# Altium project PCB_Project.PrjPcb (part 1 of 2)
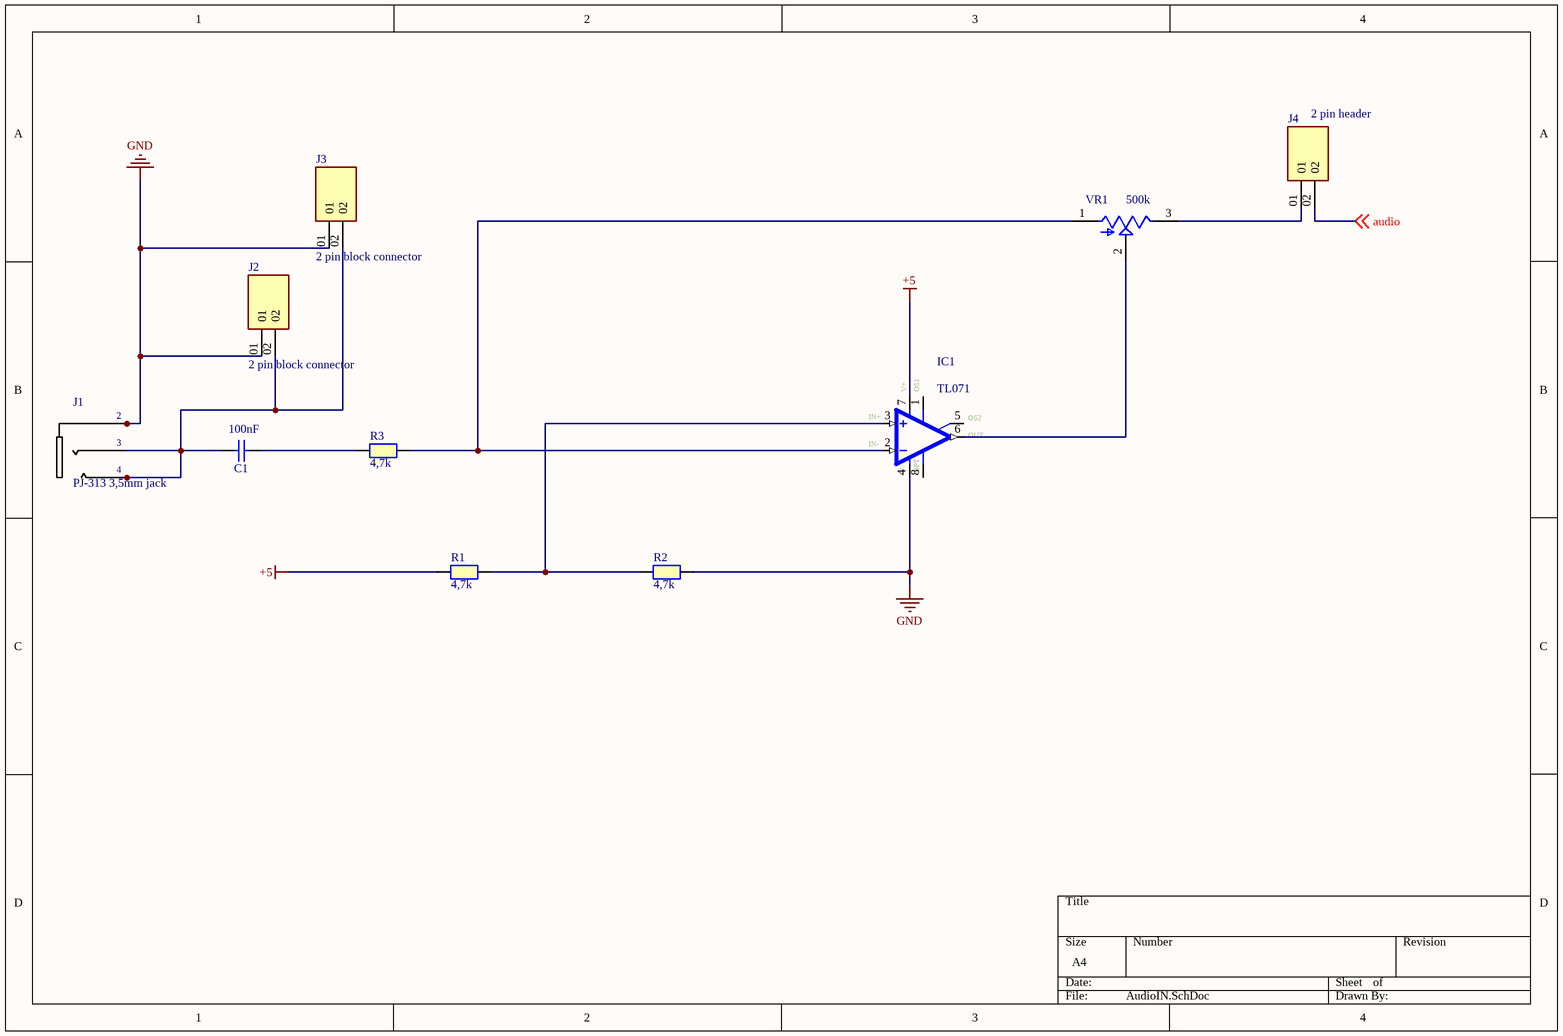
[diagram p0: AudioIN.SchDoc]
6 sheets, 237 parts. Net scope: global (net labels, ports and power ports of the same name join across sheets).
Board file: MB_SpectrumAnalyzerB.PcbDoc
Sheets:
  AudioIN.SchDoc
  spectrum_8kHz_64Hz.SchDoc
  spectrum_4kHz_125Hz.SchDoc
  spectrum_2kHz_250Hz.SchDoc
  spectrum_1kHz_500Hz.SchDoc
  AudioOUT.SchDoc

## Sheet AudioIN.SchDoc
size A4; SheetNumber: 1; SheetTotal: 6

### Parts
C1  100nF  [CAPC2012X65N]
IC1  TL071  [DIL08]
J1  PJ-313 3,5mm jack  [*PJ-313_PJ-313(Primary)]
J2  2 pin block connector  [691210910002]
J3  2 pin block connector  [691210910002]
J4  2 pin header  [SAMTEC_HTSW-102-07-TM-S]
R1  4,7k  [RESC2012X50N]
R2  4,7k  [RESC2012X50N]
R3  4,7k  [RESC2012X50N]
VR1  500k  [TRIM_3362P-1-253LF]

### Nets
+5: IC1.7(V+) R1.1
GND: IC1.4(V-) J1.2_1 J1.2_2 J2.01 J3.01 R2.2
audio: J4.02 ; off-sheet audio
NetC1_1: C1.1 J1.3 J1.4_1 J1.4_2 J2.02 J3.02
NetC1_2: C1.2 R3.1
NetIC1_2: IC1.2(-IN) R3.2 VR1.1(CCW)
NetIC1_3: IC1.3(+IN) R1.2 R2.1
NetIC1_6: IC1.6(OUT) VR1.2(WIPER)
NetJ4_01: J4.01 VR1.3(CW)

Not connected (* = marked no-connect by the designer): IC1 1(ON1) 5(ON2) 8(OPT)

### Notes on the sheet
- (in symbol TL071) OS1; IN+; OS2; IN-

### Library data of the parts
C1 = 885012004008: 100nF Keramic cap; Manufacturer: Wurth Elektronik; Match Code: WCAP-CSGP; Case/Size Code: 0201; Capacitance: 22pF; Capacitance Tolerance: +/-5%; Ceramic Type: NP0 Class I; Insulation Resistance: 10GΩ; Q Factor: 840; Rated Voltage (DC): 25V; Technical Reference: NP00201220J025DFCT10000; Manufacturer Part Number: 885012004008; Category: Multilayer Ceramic Chip Capacitors; ComponentLink1Description: Website Link; ComponentLink1URL: https://www.we-online.com/redexpert/article/885012004008?ad; ComponentLink2Description: Datasheet Link; ComponentLink2URL: https://www.we-online.com/redexpert/spec/885012004008?ad; Mount: Surface Mount; Operating Temperature Max: 125°C; Operating Temperature Min: -55°C; Packaging: Tape and Reel; Length: 0.6mm; Width: 0.3mm; Height: 0.3mm
IC1 = TL071: J-FET Amplifier 1 Circuit 8-SO; MF: STMicroelectronics; Price: None; SnapEDA_Link: https://www.snapeda.com/parts/TL071/STMicroelectronics/view-part/1566080/?ref=snap; Availability: Unavailable; Value: *; MP: TL071; Package: SOIC-8 STMicroelectronics
J1 = PJ-313: 3,5cm jack; MP: PJ313; MF: ADC Telecommunications; Package: None; Availability: Not in stock; Check_prices: https://www.snapeda.com/parts/PJ313/ADC+Telecommunications/view-part/?ref=eda; SnapEDA_Link: https://www.snapeda.com/parts/PJ313/ADC+Telecommunications/view-part/?ref=snap; Price: None; Value: *
J2 J3 = 2 pin header: HEADER, 2 CONTACTS, 1 ROW, THROUGH HOLE, 2.54 MM; Connector Systems:Board-to-Board; Pitch Spacing:2.54mm; No. of Rows:1Rows; No. of Contacts:2Contacts; Contact Termination Type:Through Hole; Product Range:HTSW Series; Gender:Header RoHS Compliant: Yes; MP: HTSW10207TMS; MF: Samtec; SnapEDA_Link: https://www.snapeda.com/parts/HTSW10207TMS/Samtec/view-part/?ref=snap; Value: *; Purchase-URL: https://pricing.snapeda.com/search/part/HTSW10207TMS/?ref=eda; Availability: In Stock; Check_prices: https://www.snapeda.com/parts/HTSW10207TMS/Samtec/view-part/?ref=eda; Package: None; Price: None
J4 = 2 pin header: 2 pin header Jumper; MP: HTSW10207TMS; MF: Samtec; SnapEDA_Link: https://www.snapeda.com/parts/HTSW10207TMS/Samtec/view-part/?ref=snap; Value: *; Purchase-URL: https://pricing.snapeda.com/search/part/HTSW10207TMS/?ref=eda; Availability: In Stock; Check_prices: https://www.snapeda.com/parts/HTSW10207TMS/Samtec/view-part/?ref=eda; Package: None; Price: None
R1-R3 = RESISTOR 0805: 4,7k Resistor 0805; Part Number: TNPW080510K0BETA; Manufacturer: Vishay Dale
VR1 = 3362P-1-253LF: 25 kOhms 0.5W, 1/2W PC Pins Through Hole Trimmer Potentiometer Cermet 1 Turn Top Adjustment; MF: Bourns; Check_prices: https://www.snapeda.com/parts/3362P-1-253LF/Bourns/view-part/493663/?ref=eda; SnapEDA_Link: https://www.snapeda.com/parts/3362P-1-253LF/Bourns/view-part/493663/?ref=snap; Availability: Good; Value: *; Purchase-URL: https://pricing.snapeda.com/search/part/3362P-1-253LF/?ref=eda; Price: None; MP: 3362P-1-253LF; Package: 3116 Bourns

## Sheet spectrum_8kHz_64Hz.SchDoc
size A4; SheetNumber: 2; SheetTotal: 6
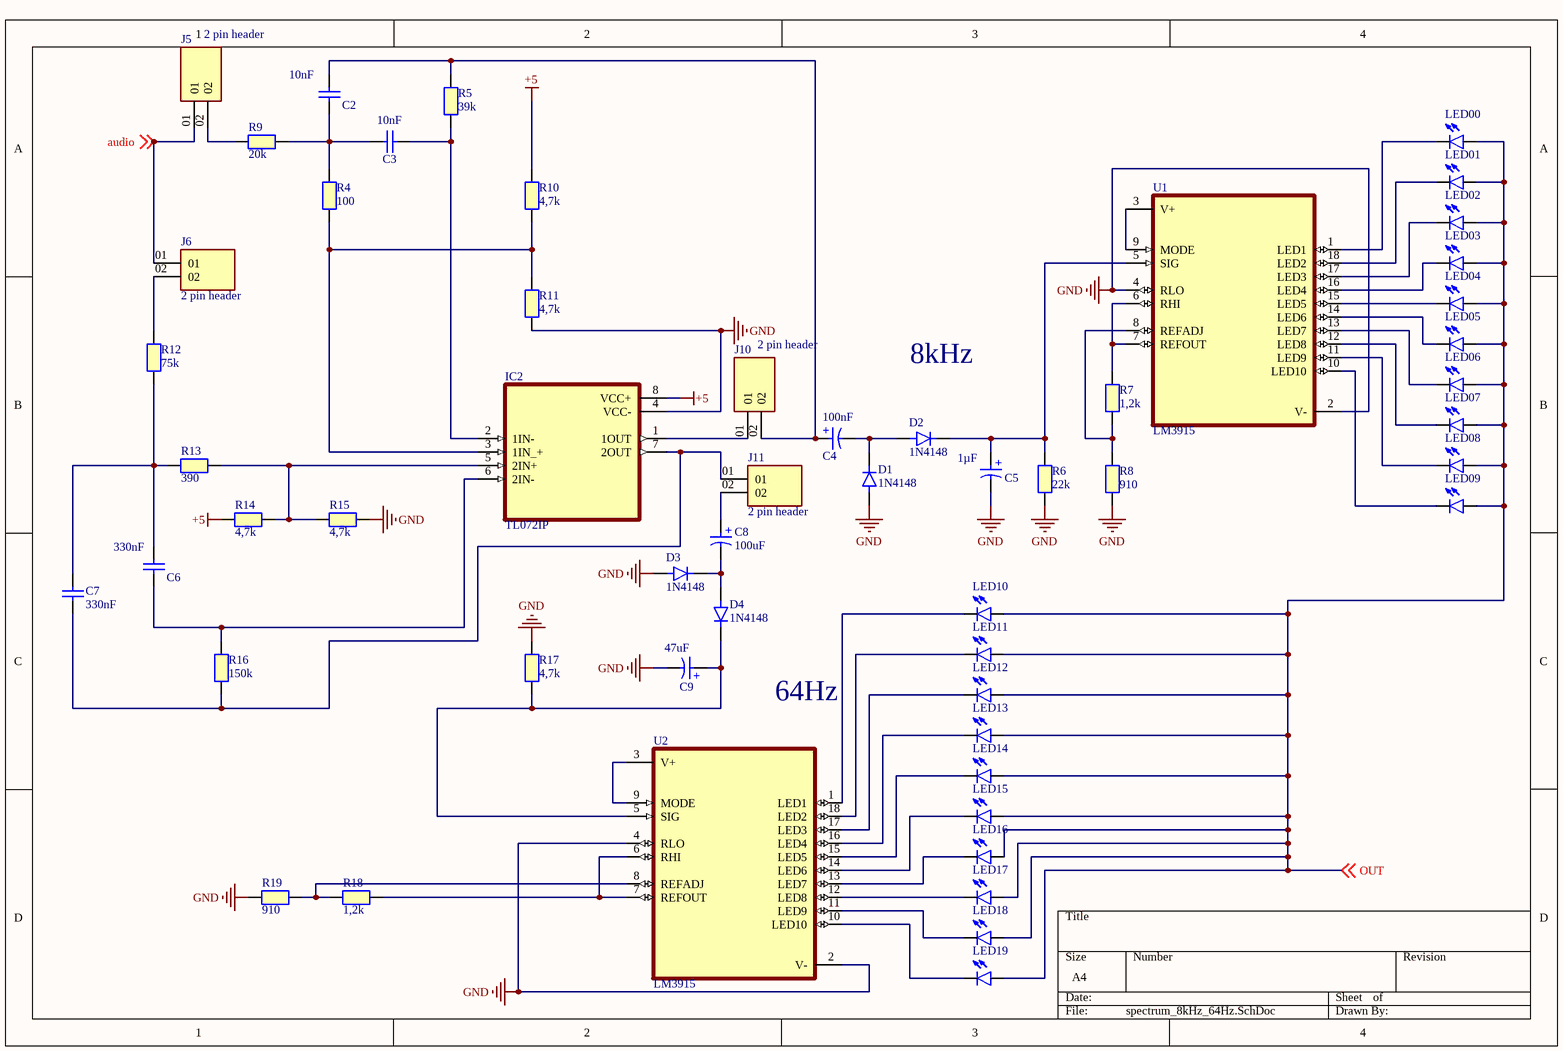
[diagram p1: spectrum_8kHz_64Hz.SchDoc]

### Parts
C2  10nF  [CAPC2012X65N]
C3  10nF  [CAPC2012X65N]
C4  100nF  [WCAP-ATG8_D5H11]
C5  1µF  [WCAP-ATG8_D5H11]
C6  330nF  [CAPC2012X65N]
C7  330nF  [CAPC2012X65N]
C8  100uF  [WCAP-ATG8_D5H11]
C9  47uF  [WCAP-ATG8_D5H11]
D1  1N4148  [DIOAD829W49L456D191]
D2  1N4148  [DIOAD829W49L456D191]
D3  1N4148  [DIOAD829W49L456D191]
D4  1N4148  [DIOAD829W49L456D191]
IC2  TL072IP  [DIP794W45P254L959H508Q8]
J5  2 pin header  [SAMTEC_HTSW-102-07-TM-S]
J6  2 pin header  [SAMTEC_HTSW-102-07-TM-S]
J10  2 pin header  [SAMTEC_HTSW-102-07-TM-S]
J11  2 pin header  [SAMTEC_HTSW-102-07-TM-S]
LED00  LED 2x3x4  [LED 2x3x4mm]  (value not drawn)
LED01  LED 2x3x4  [LED 2x3x4mm]  (value not drawn)
LED02  LED 2x3x4  [LED 2x3x4mm]  (value not drawn)
LED03  LED 2x3x4  [LED 2x3x4mm]  (value not drawn)
LED04  LED 2x3x4  [LED 2x3x4mm]  (value not drawn)
LED05  LED 2x3x4  [LED 2x3x4mm]  (value not drawn)
LED06  LED 2x3x4  [LED 2x3x4mm]  (value not drawn)
LED07  LED 2x3x4  [LED 2x3x4mm]  (value not drawn)
LED08  LED 2x3x4  [LED 2x3x4mm]  (value not drawn)
LED09  LED 2x3x4  [LED 2x3x4mm]  (value not drawn)
LED10  LED 2x3x4  [LED 2x3x4mm]  (value not drawn)
LED11  LED 2x3x4  [LED 2x3x4mm]  (value not drawn)
LED12  LED 2x3x4  [LED 2x3x4mm]  (value not drawn)
LED13  LED 2x3x4  [LED 2x3x4mm]  (value not drawn)
LED14  LED 2x3x4  [LED 2x3x4mm]  (value not drawn)
LED15  LED 2x3x4  [LED 2x3x4mm]  (value not drawn)
LED16  LED 2x3x4  [LED 2x3x4mm]  (value not drawn)
LED17  LED 2x3x4  [LED 2x3x4mm]  (value not drawn)
LED18  LED 2x3x4  [LED 2x3x4mm]  (value not drawn)
LED19  LED 2x3x4  [LED 2x3x4mm]  (value not drawn)
R4  100  [RESC2012X50N]
R5  39k  [RESC2012X50N]
R6  22k  [RESC2012X50N]
R7  1,2k  [RESC2012X50N]
R8  910  [RESC2012X50N]
R9  20k  [RESC2012X50N]
R10  4,7k  [RESC2012X50N]
R11  4,7k  [RESC2012X50N]
R12  75k  [RESC2012X50N]
R13  390  [RESC2012X50N]
R14  4,7k  [RESC2012X50N]
R15  4,7k  [RESC2012X50N]
R16  150k  [RESC2012X50N]
R17  4,7k  [RESC2012X50N]
R18  1,2k  [RESC2012X50N]
R19  910  [RESC2012X50N]
U1  LM3915  [DIP952W45P254L2336H533Q18]
U2  LM3915  [DIP952W45P254L2336H533Q18]

### Nets
+5: IC2.8(VCC+) R10.2 R14.2
GND: C5.2(N) C9.2(N) D1.A D3.A IC2.4(VCC-) R6.1 R8.2 R11.1 R15.2 R17.1 R19.2 U1.2(V-) U1.4(RLO) U2.2(V-) U2.4(RLO)
audio: J5.01 J6.01 ; off-sheet audio
OUT: LED00.A LED01.A LED02.A LED03.A LED04.A LED05.A LED06.A LED07.A LED08.A LED09.A LED10.A LED11.A LED12.A LED13.A LED14.A LED15.A LED16.A LED17.A LED18.A LED19.A ; off-sheet OUT
NetC2_1: C2.1 C3.1 R4.2 R9.2
NetC2_2: C2.2 C4.1(P) J10.02 R5.2
NetC3_2: C3.2 IC2.2(1IN-) R5.1
NetC4_2: C4.2(N) D1.C D2.A
NetC5_1: C5.1(P) D2.C R6.2 U1.5(SIG)
NetC6_1: C6.1 IC2.6(2IN-) R16.2
NetC6_2: C6.2 C7.2 R12.1 R13.2
NetC7_1: C7.1 IC2.7(2OUT) J11.01 R16.1
NetC8_1: C8.1(P) J11.02
NetC8_2: C8.2(N) D3.C D4.A
NetC9_1: C9.1(P) D4.C R17.2 U2.5(SIG)
NetIC2_1: IC2.1(1OUT) J10.01
NetIC2_3: IC2.3(1IN_+) R4.1 R10.1 R11.2
NetIC2_5: IC2.5(2IN+) R13.1 R14.1 R15.1
NetJ5_02: J5.02 R9.1
NetJ6_02: J6.02 R12.2
NetLED00_K: LED00.K(C) U1.1(LED1)
NetLED01_K: LED01.K(C) U1.18(LED2)
NetLED02_K: LED02.K(C) U1.17(LED3)
NetLED03_K: LED03.K(C) U1.16(LED4)
NetLED04_K: LED04.K(C) U1.15(LED5)
NetLED05_K: LED05.K(C) U1.14(LED6)
NetLED06_K: LED06.K(C) U1.13(LED7)
NetLED07_K: LED07.K(C) U1.12(LED8)
NetLED08_K: LED08.K(C) U1.11(LED9)
NetLED09_K: LED09.K(C) U1.10(LED10)
NetLED10_K: LED10.K(C) U2.1(LED1)
NetLED11_K: LED11.K(C) U2.18(LED2)
NetLED12_K: LED12.K(C) U2.17(LED3)
NetLED13_K: LED13.K(C) U2.16(LED4)
NetLED14_K: LED14.K(C) U2.15(LED5)
NetLED15_K: LED15.K(C) U2.14(LED6)
NetLED16_K: LED16.K(C) U2.13(LED7)
NetLED17_K: LED17.K(C) U2.12(LED8)
NetLED18_K: LED18.K(C) U2.11(LED9)
NetLED19_K: LED19.K(C) U2.10(LED10)
NetR7_1: R7.1 U1.6(RHI) U1.7(REFOUT)
NetR7_2: R7.2 R8.1 U1.8(REFADJ)
NetR18_1: R18.1 U2.6(RHI) U2.7(REFOUT)
NetR18_2: R18.2 R19.1 U2.8(REFADJ)
NetU1_3: U1.3(V+) U1.9(MODE)
NetU2_3: U2.3(V+) U2.9(MODE)

### Notes on the sheet
- 8kHz
- 64Hz
- (in symbol 860010272005) +

### Library data of the parts
C2 C3 = 885012004008: 10nF ceramic; Manufacturer: Wurth Elektronik; Match Code: WCAP-CSGP; Case/Size Code: 0201; Capacitance: 22pF; Capacitance Tolerance: +/-5%; Ceramic Type: NP0 Class I; Insulation Resistance: 10GΩ; Q Factor: 840; Rated Voltage (DC): 25V; Technical Reference: NP00201220J025DFCT10000; Manufacturer Part Number: 885012004008; Category: Multilayer Ceramic Chip Capacitors; ComponentLink1Description: Website Link; ComponentLink1URL: https://www.we-online.com/redexpert/article/885012004008?ad; ComponentLink2Description: Datasheet Link; ComponentLink2URL: https://www.we-online.com/redexpert/spec/885012004008?ad; Mount: Surface Mount; Operating Temperature Max: 125°C; Operating Temperature Min: -55°C; Packaging: Tape and Reel; Length: 0.6mm; Width: 0.3mm; Height: 0.3mm
C4 = 860010272005: Elco 100nF; Manufacturer: Wurth Elektronik; Match Code: WCAP-ATG8; Capacitance: 100µF; Capacitance Tolerance: +/-20%; Dissipation Factor: 19%; Endurance: 2000h; Leakage Current: 10µA; Rated Voltage (DC): 10V; Ripple Current: 198mA; Technical Reference: ATBC110101M010DSPA3B000; Manufacturer Part Number: 860010272005; Category: Aluminum Electrolytic Capacitors; ComponentLink1Description: Website Link; ComponentLink1URL: https://www.we-online.com/redexpert/article/860010272005?ad; ComponentLink2Description: Datasheet Link; ComponentLink2URL: https://www.we-online.com/redexpert/spec/860010272005?ad; Mount: Through Hole; Operating Temperature Max: 85°C; Operating Temperature Min: -40°C; Packaging: Ammo Pack; Height: 11mm; Diameter: 5mm
C5 = 860010272005: WCAP-ATG8 Aluminum Electrolytic Capacitor, Radial, THT, D5 x H11mm, 1uF, 10V; Manufacturer: Wurth Elektronik; Capacitance: 100µF; Capacitance Tolerance: +/-20%; Dissipation Factor: 19%; Endurance: 2000h; Leakage Current: 10µA; Ripple Current: 198mA; Technical Reference: ATBC110101M010DSPA3B000; Manufacturer Part Number: 860010272005; Category: Aluminum Electrolytic Capacitors; Match Code: WCAP-ATG8; ComponentLink1Description: Website Link; ComponentLink1URL: https://www.we-online.com/redexpert/article/860010272005?ad; ComponentLink2Description: Datasheet Link; ComponentLink2URL: https://www.we-online.com/redexpert/spec/860010272005?ad; Mount: Through Hole; Operating Temperature Max: 85°C; Operating Temperature Min: -40°C; Packaging: Ammo Pack; Height: 11mm; Diameter: 5mm; Rated Voltage (DC): 10V
C6 C7 = 885012004008: 330nF ceramic; Manufacturer: Wurth Elektronik; Match Code: WCAP-CSGP; Case/Size Code: 0201; Capacitance: 22pF; Capacitance Tolerance: +/-5%; Ceramic Type: NP0 Class I; Insulation Resistance: 10GΩ; Q Factor: 840; Rated Voltage (DC): 25V; Technical Reference: NP00201220J025DFCT10000; Manufacturer Part Number: 885012004008; Category: Multilayer Ceramic Chip Capacitors; ComponentLink1Description: Website Link; ComponentLink1URL: https://www.we-online.com/redexpert/article/885012004008?ad; ComponentLink2Description: Datasheet Link; ComponentLink2URL: https://www.we-online.com/redexpert/spec/885012004008?ad; Mount: Surface Mount; Operating Temperature Max: 125°C; Operating Temperature Min: -55°C; Packaging: Tape and Reel; Length: 0.6mm; Width: 0.3mm; Height: 0.3mm
C8 = 860010272005: Elco 100uF; Manufacturer: Wurth Elektronik; Match Code: WCAP-ATG8; Capacitance: 100µF; Capacitance Tolerance: +/-20%; Dissipation Factor: 19%; Endurance: 2000h; Leakage Current: 10µA; Rated Voltage (DC): 10V; Ripple Current: 198mA; Technical Reference: ATBC110101M010DSPA3B000; Manufacturer Part Number: 860010272005; Category: Aluminum Electrolytic Capacitors; ComponentLink1Description: Website Link; ComponentLink1URL: https://www.we-online.com/redexpert/article/860010272005?ad; ComponentLink2Description: Datasheet Link; ComponentLink2URL: https://www.we-online.com/redexpert/spec/860010272005?ad; Mount: Through Hole; Operating Temperature Max: 85°C; Operating Temperature Min: -40°C; Packaging: Ammo Pack; Height: 11mm; Diameter: 5mm
C9 = 860010272005: WCAP-ATG8 Aluminum Electrolytic Capacitor, Radial, THT, D5 x H11mm, 47µF, 10V; Manufacturer: Wurth Elektronik; Capacitance: 100µF; Capacitance Tolerance: +/-20%; Dissipation Factor: 19%; Endurance: 2000h; Leakage Current: 10µA; Ripple Current: 198mA; Technical Reference: ATBC110101M010DSPA3B000; Manufacturer Part Number: 860010272005; Category: Aluminum Electrolytic Capacitors; Match Code: WCAP-ATG8; ComponentLink1Description: Website Link; ComponentLink1URL: https://www.we-online.com/redexpert/article/860010272005?ad; ComponentLink2Description: Datasheet Link; ComponentLink2URL: https://www.we-online.com/redexpert/spec/860010272005?ad; Mount: Through Hole; Operating Temperature Max: 85°C; Operating Temperature Min: -40°C; Packaging: Ammo Pack; Height: 11mm; Diameter: 5mm; Rated Voltage (DC): 10V
D1-D4 = 1N4148: Diode Standard 75V 200mA Surface Mount SOD-523F; MF: ON Semiconductor; Price: None; Availability: In Stock; Package: AXIAL LEAD-2 ON Semiconductor; MP: 1N4148; Value: *; SnapEDA_Link: https://www.snapeda.com/parts/1N4148/Onsemi/view-part/?ref=snap; Purchase-URL: https://pricing.snapeda.com/search/part/1N4148/?ref=eda; Check_prices: https://www.snapeda.com/parts/1N4148/Onsemi/view-part/?ref=eda
IC2 = TL072IP: Dual, 30-V, 3-MHz, high slew rate (13-V/Âµs), In to V+, JFET-input op amp; MF: Texas Instruments; Price: None; Package: PDIP-8 Texas; Purchase-URL: https://pricing.snapeda.com/search/part/TL072IP/?ref=eda; Availability: In Stock; SnapEDA_Link: https://www.snapeda.com/parts/TL072IP/Texas+Instruments/view-part/?ref=snap; Value: *; MP: TL072IP; Check_prices: https://www.snapeda.com/parts/TL072IP/Texas+Instruments/view-part/?ref=eda
J5 J6 J10 J11 = 2 pin header: as J4 on sheet AudioIN; SnapEDA_Link: https://www.snapeda.com/parts/HTSW10207TMS/Samtec/view-part/?ref=snap; Value: *; Purchase-URL: https://pricing.snapeda.com/search/part/HTSW10207TMS/?ref=eda; Availability: In Stock; Check_prices: https://www.snapeda.com/parts/HTSW10207TMS/Samtec/view-part/?ref=eda; Package: None; Price: None
LED00 LED01 LED02 LED03 LED04 LED05 LED06 LED07 LED08 LED09-LED19 = LED 2x3x4: Green 569nm LED Indication - Discrete 1.9V Radial; MP: TLLG4400; MF: Vishay Semiconductors; SnapEDA_Link: https://www.snapeda.com/parts/TLLG4400/Vishay/view-part/?ref=snap; Availability: In Stock; Package: None; Check_prices: https://www.snapeda.com/parts/TLLG4400/Vishay/view-part/?ref=eda; Value: *; Purchase-URL: https://pricing.snapeda.com/search/part/TLLG4400/?ref=eda; Price: None
R4 = RESISTOR 0805: 100Ohm Resistor 0805; Part Number: TNPW080510K0BETA; Manufacturer: Vishay Dale
R5 R10 R11 R14 R15 R17 = RESISTOR 0805: as R1 on sheet AudioIN
R6 = RESISTOR 0805: 22k Resistor 0805; Part Number: TNPW080510K0BETA; Manufacturer: Vishay Dale
R7 R18 = RESISTOR 0805: 1,2k Resistor 0805; Part Number: TNPW080510K0BETA; Manufacturer: Vishay Dale
R8 R19 = RESISTOR 0805: 910 Resistor 0805; Part Number: TNPW080510K0BETA; Manufacturer: Vishay Dale
R9 = RESISTOR 0805: 20k Resistor 0805; Part Number: TNPW080510K0BETA; Manufacturer: Vishay Dale
R12 = RESISTOR 0805: 75k Resistor 0805; Part Number: TNPW080510K0BETA; Manufacturer: Vishay Dale
R13 = RESISTOR 0805: 390 Resistor 0805; Part Number: TNPW080510K0BETA; Manufacturer: Vishay Dale
R16 = RESISTOR 0805: 150k Resistor 0805; Part Number: TNPW080510K0BETA; Manufacturer: Vishay Dale
U1 U2 = LM3915: MP: LM3914N-1; Package: None; Availability: Unavailable; Price: None; Value: *

## Sheet spectrum_4kHz_125Hz.SchDoc
size A4; SheetNumber: 3; SheetTotal: 6
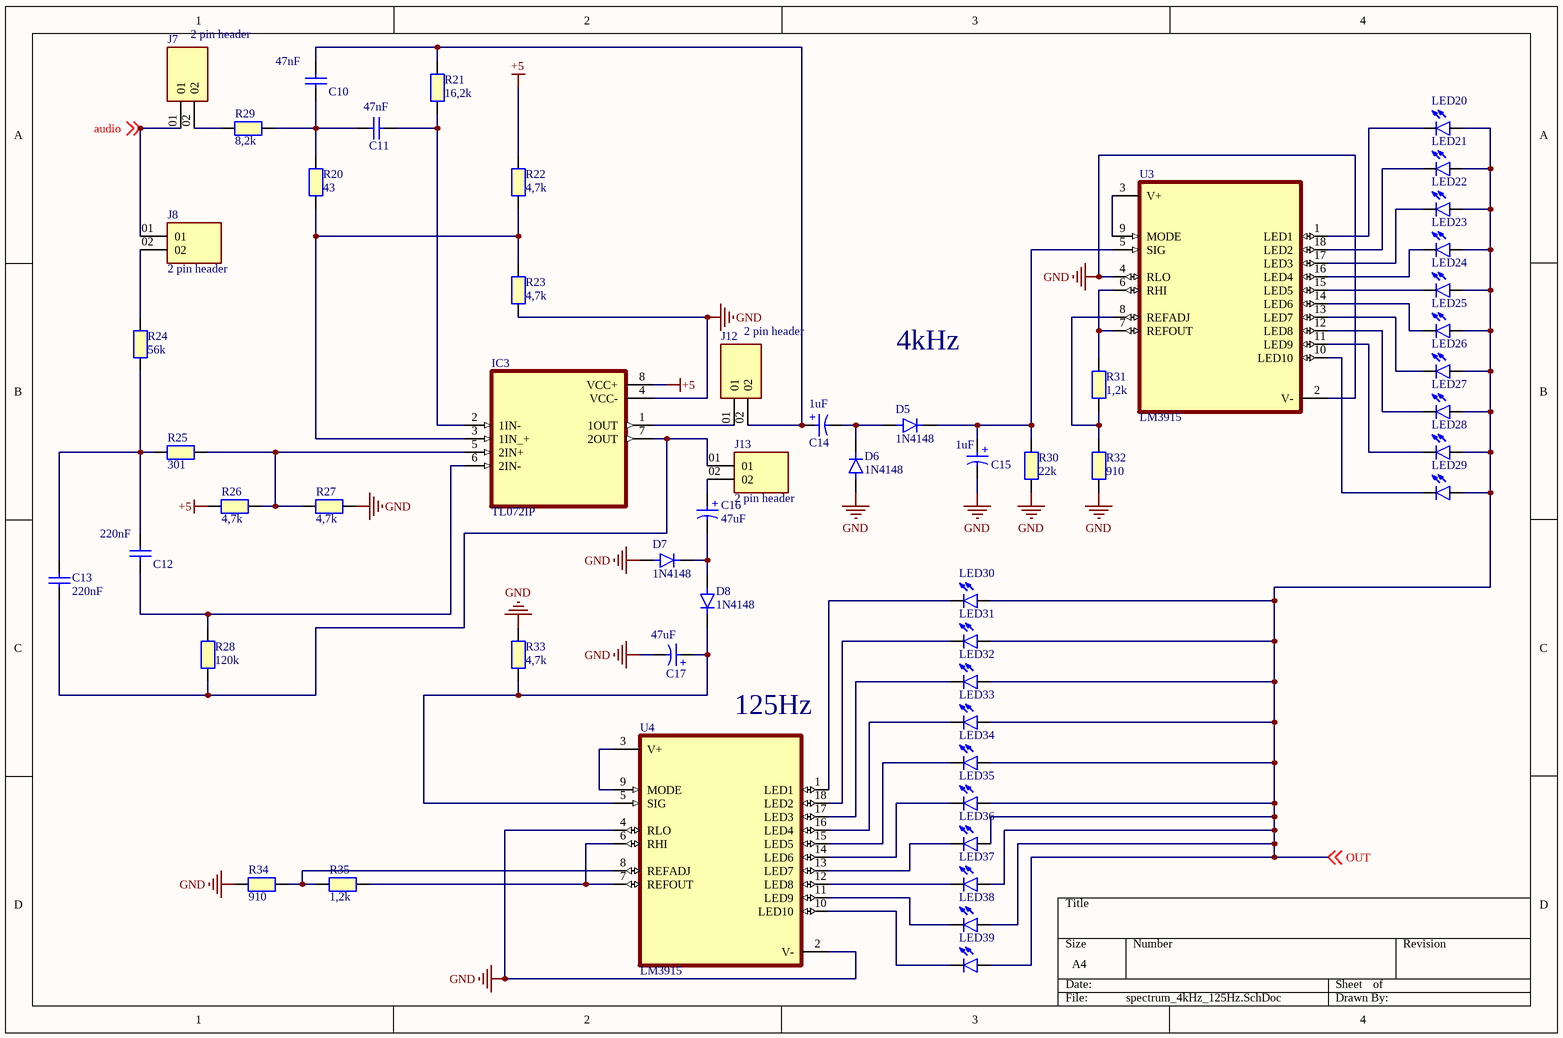
[diagram p2: spectrum_4kHz_125Hz.SchDoc]

### Parts
C10  47nF  [CAPC2012X65N]
C11  47nF  [CAPC2012X65N]
C12  220nF  [CAPC2012X65N]
C13  220nF  [CAPC2012X65N]
C14  1uF  [WCAP-ATG8_D5H11]
C15  1uF  [WCAP-ATG8_D5H11]
C16  47uF  [WCAP-ATG8_D5H11]
C17  47uF  [WCAP-ATG8_D5H11]
D5  1N4148  [DIOAD829W49L456D191]
D6  1N4148  [DIOAD829W49L456D191]
D7  1N4148  [DIOAD829W49L456D191]
D8  1N4148  [DIOAD829W49L456D191]
IC3  TL072IP  [DIP794W45P254L959H508Q8]
J7  2 pin header  [SAMTEC_HTSW-102-07-TM-S]
J8  2 pin header  [SAMTEC_HTSW-102-07-TM-S]
J12  2 pin header  [SAMTEC_HTSW-102-07-TM-S]
J13  2 pin header  [SAMTEC_HTSW-102-07-TM-S]
LED20  LED 2x3x4  [LED 2x3x4mm]  (value not drawn)
LED21  LED 2x3x4  [LED 2x3x4mm]  (value not drawn)
LED22  LED 2x3x4  [LED 2x3x4mm]  (value not drawn)
LED23  LED 2x3x4  [LED 2x3x4mm]  (value not drawn)
LED24  LED 2x3x4  [LED 2x3x4mm]  (value not drawn)
LED25  LED 2x3x4  [LED 2x3x4mm]  (value not drawn)
LED26  LED 2x3x4  [LED 2x3x4mm]  (value not drawn)
LED27  LED 2x3x4  [LED 2x3x4mm]  (value not drawn)
LED28  LED 2x3x4  [LED 2x3x4mm]  (value not drawn)
LED29  LED 2x3x4  [LED 2x3x4mm]  (value not drawn)
LED30  LED 2x3x4  [LED 2x3x4mm]  (value not drawn)
LED31  LED 2x3x4  [LED 2x3x4mm]  (value not drawn)
LED32  LED 2x3x4  [LED 2x3x4mm]  (value not drawn)
LED33  LED 2x3x4  [LED 2x3x4mm]  (value not drawn)
LED34  LED 2x3x4  [LED 2x3x4mm]  (value not drawn)
LED35  LED 2x3x4  [LED 2x3x4mm]  (value not drawn)
LED36  LED 2x3x4  [LED 2x3x4mm]  (value not drawn)
LED37  LED 2x3x4  [LED 2x3x4mm]  (value not drawn)
LED38  LED 2x3x4  [LED 2x3x4mm]  (value not drawn)
LED39  LED 2x3x4  [LED 2x3x4mm]  (value not drawn)
R20  43  [RESC2012X50N]
R21  16,2k  [RESC2012X50N]
R22  4,7k  [RESC2012X50N]
R23  4,7k  [RESC2012X50N]
R24  56k  [RESC2012X50N]
R25  301  [RESC2012X50N]
R26  4,7k  [RESC2012X50N]
R27  4,7k  [RESC2012X50N]
R28  120k  [RESC2012X50N]
R29  8,2k  [RESC2012X50N]
R30  22k  [RESC2012X50N]
R31  1,2k  [RESC2012X50N]
R32  910  [RESC2012X50N]
R33  4,7k  [RESC2012X50N]
R34  910  [RESC2012X50N]
R35  1,2k  [RESC2012X50N]
U3  LM3915  [DIP952W45P254L2336H533Q18]
U4  LM3915  [DIP952W45P254L2336H533Q18]

### Nets
+5: IC3.8(VCC+) R22.2 R26.2
GND: C15.2(N) C17.2(N) D6.A D7.A IC3.4(VCC-) R23.1 R27.2 R30.1 R32.2 R33.1 R34.2 U3.2(V-) U3.4(RLO) U4.2(V-) U4.4(RLO)
audio: J7.01 J8.01 ; off-sheet audio
OUT: LED20.A LED21.A LED22.A LED23.A LED24.A LED25.A LED26.A LED27.A LED28.A LED29.A LED30.A LED31.A LED32.A LED33.A LED34.A LED35.A LED36.A LED37.A LED38.A LED39.A ; off-sheet OUT
NetC10_1: C10.1 C11.1 R20.2 R29.2
NetC10_2: C10.2 C14.1(P) J12.02 R21.2
NetC11_2: C11.2 IC3.2(1IN-) R21.1
NetC12_1: C12.1 IC3.6(2IN-) R28.2
NetC12_2: C12.2 C13.2 R24.1 R25.2
NetC13_1: C13.1 IC3.7(2OUT) J13.01 R28.1
NetC14_2: C14.2(N) D5.A D6.C
NetC15_1: C15.1(P) D5.C R30.2 U3.5(SIG)
NetC16_1: C16.1(P) J13.02
NetC16_2: C16.2(N) D7.C D8.A
NetC17_1: C17.1(P) D8.C R33.2 U4.5(SIG)
NetIC3_1: IC3.1(1OUT) J12.01
NetIC3_3: IC3.3(1IN_+) R20.1 R22.1 R23.2
NetIC3_5: IC3.5(2IN+) R25.1 R26.1 R27.1
NetJ7_02: J7.02 R29.1
NetJ8_02: J8.02 R24.2
NetLED20_K: LED20.K(C) U3.1(LED1)
NetLED21_K: LED21.K(C) U3.18(LED2)
NetLED22_K: LED22.K(C) U3.17(LED3)
NetLED23_K: LED23.K(C) U3.16(LED4)
NetLED24_K: LED24.K(C) U3.15(LED5)
NetLED25_K: LED25.K(C) U3.14(LED6)
NetLED26_K: LED26.K(C) U3.13(LED7)
NetLED27_K: LED27.K(C) U3.12(LED8)
NetLED28_K: LED28.K(C) U3.11(LED9)
NetLED29_K: LED29.K(C) U3.10(LED10)
NetLED30_K: LED30.K(C) U4.1(LED1)
NetLED31_K: LED31.K(C) U4.18(LED2)
NetLED32_K: LED32.K(C) U4.17(LED3)
NetLED33_K: LED33.K(C) U4.16(LED4)
NetLED34_K: LED34.K(C) U4.15(LED5)
NetLED35_K: LED35.K(C) U4.14(LED6)
NetLED36_K: LED36.K(C) U4.13(LED7)
NetLED37_K: LED37.K(C) U4.12(LED8)
NetLED38_K: LED38.K(C) U4.11(LED9)
NetLED39_K: LED39.K(C) U4.10(LED10)
NetR31_1: R31.1 U3.6(RHI) U3.7(REFOUT)
NetR31_2: R31.2 R32.1 U3.8(REFADJ)
NetR34_1: R34.1 R35.2 U4.8(REFADJ)
NetR35_1: R35.1 U4.6(RHI) U4.7(REFOUT)
NetU3_3: U3.3(V+) U3.9(MODE)
NetU4_3: U4.3(V+) U4.9(MODE)

### Notes on the sheet
- 4kHz
- (near U4) 125Hz
- (in symbol 860010272005) +

### Library data of the parts
C10 C11 = 885012004008: 47nF ceramic; Manufacturer: Wurth Elektronik; Match Code: WCAP-CSGP; Case/Size Code: 0201; Capacitance: 22pF; Capacitance Tolerance: +/-5%; Ceramic Type: NP0 Class I; Insulation Resistance: 10GΩ; Q Factor: 840; Rated Voltage (DC): 25V; Technical Reference: NP00201220J025DFCT10000; Manufacturer Part Number: 885012004008; Category: Multilayer Ceramic Chip Capacitors; ComponentLink1Description: Website Link; ComponentLink1URL: https://www.we-online.com/redexpert/article/885012004008?ad; ComponentLink2Description: Datasheet Link; ComponentLink2URL: https://www.we-online.com/redexpert/spec/885012004008?ad; Mount: Surface Mount; Operating Temperature Max: 125°C; Operating Temperature Min: -55°C; Packaging: Tape and Reel; Length: 0.6mm; Width: 0.3mm; Height: 0.3mm
C12 C13 = 885012004008: 220nF ceramic; Manufacturer: Wurth Elektronik; Match Code: WCAP-CSGP; Case/Size Code: 0201; Capacitance: 22pF; Capacitance Tolerance: +/-5%; Ceramic Type: NP0 Class I; Insulation Resistance: 10GΩ; Q Factor: 840; Rated Voltage (DC): 25V; Technical Reference: NP00201220J025DFCT10000; Manufacturer Part Number: 885012004008; Category: Multilayer Ceramic Chip Capacitors; ComponentLink1Description: Website Link; ComponentLink1URL: https://www.we-online.com/redexpert/article/885012004008?ad; ComponentLink2Description: Datasheet Link; ComponentLink2URL: https://www.we-online.com/redexpert/spec/885012004008?ad; Mount: Surface Mount; Operating Temperature Max: 125°C; Operating Temperature Min: -55°C; Packaging: Tape and Reel; Length: 0.6mm; Width: 0.3mm; Height: 0.3mm
C14 = 860010272005: Elco 1uF; Manufacturer: Wurth Elektronik; Match Code: WCAP-ATG8; Capacitance: 100µF; Capacitance Tolerance: +/-20%; Dissipation Factor: 19%; Endurance: 2000h; Leakage Current: 10µA; Rated Voltage (DC): 10V; Ripple Current: 198mA; Technical Reference: ATBC110101M010DSPA3B000; Manufacturer Part Number: 860010272005; Category: Aluminum Electrolytic Capacitors; ComponentLink1Description: Website Link; ComponentLink1URL: https://www.we-online.com/redexpert/article/860010272005?ad; ComponentLink2Description: Datasheet Link; ComponentLink2URL: https://www.we-online.com/redexpert/spec/860010272005?ad; Mount: Through Hole; Operating Temperature Max: 85°C; Operating Temperature Min: -40°C; Packaging: Ammo Pack; Height: 11mm; Diameter: 5mm
C15 = 860010272005: as C5 on sheet spectrum_8kHz_64Hz; Manufacturer Part Number: 860010272005; Category: Aluminum Electrolytic Capacitors; Match Code: WCAP-ATG8; ComponentLink1Description: Website Link; ComponentLink1URL: https://www.we-online.com/redexpert/article/860010272005?ad; ComponentLink2Description: Datasheet Link; ComponentLink2URL: https://www.we-online.com/redexpert/spec/860010272005?ad; Mount: Through Hole; Operating Temperature Max: 85°C; Operating Temperature Min: -40°C; Packaging: Ammo Pack; Height: 11mm; Diameter: 5mm; Rated Voltage (DC): 10V
C16 = 860010272005: Elco 47uF; Manufacturer: Wurth Elektronik; Match Code: WCAP-ATG8; Capacitance: 100µF; Capacitance Tolerance: +/-20%; Dissipation Factor: 19%; Endurance: 2000h; Leakage Current: 10µA; Rated Voltage (DC): 10V; Ripple Current: 198mA; Technical Reference: ATBC110101M010DSPA3B000; Manufacturer Part Number: 860010272005; Category: Aluminum Electrolytic Capacitors; ComponentLink1Description: Website Link; ComponentLink1URL: https://www.we-online.com/redexpert/article/860010272005?ad; ComponentLink2Description: Datasheet Link; ComponentLink2URL: https://www.we-online.com/redexpert/spec/860010272005?ad; Mount: Through Hole; Operating Temperature Max: 85°C; Operating Temperature Min: -40°C; Packaging: Ammo Pack; Height: 11mm; Diameter: 5mm
C17 = 860010272005: as C9 on sheet spectrum_8kHz_64Hz; Manufacturer Part Number: 860010272005; Category: Aluminum Electrolytic Capacitors; Match Code: WCAP-ATG8; ComponentLink1Description: Website Link; ComponentLink1URL: https://www.we-online.com/redexpert/article/860010272005?ad; ComponentLink2Description: Datasheet Link; ComponentLink2URL: https://www.we-online.com/redexpert/spec/860010272005?ad; Mount: Through Hole; Operating Temperature Max: 85°C; Operating Temperature Min: -40°C; Packaging: Ammo Pack; Height: 11mm; Diameter: 5mm; Rated Voltage (DC): 10V
D5-D8 = 1N4148: as D1 on sheet spectrum_8kHz_64Hz; Price: None; Availability: In Stock; Package: AXIAL LEAD-2 ON Semiconductor; MP: 1N4148; Value: *; SnapEDA_Link: https://www.snapeda.com/parts/1N4148/Onsemi/view-part/?ref=snap; Purchase-URL: https://pricing.snapeda.com/search/part/1N4148/?ref=eda; Check_prices: https://www.snapeda.com/parts/1N4148/Onsemi/view-part/?ref=eda
IC3 = TL072IP: as IC2 on sheet spectrum_8kHz_64Hz; Price: None; Package: PDIP-8 Texas; Purchase-URL: https://pricing.snapeda.com/search/part/TL072IP/?ref=eda; Availability: In Stock; SnapEDA_Link: https://www.snapeda.com/parts/TL072IP/Texas+Instruments/view-part/?ref=snap; Value: *; MP: TL072IP; Check_prices: https://www.snapeda.com/parts/TL072IP/Texas+Instruments/view-part/?ref=eda
J7 J8 J12 J13 = 2 pin header: as J4 on sheet AudioIN; SnapEDA_Link: https://www.snapeda.com/parts/HTSW10207TMS/Samtec/view-part/?ref=snap; Value: *; Purchase-URL: https://pricing.snapeda.com/search/part/HTSW10207TMS/?ref=eda; Availability: In Stock; Check_prices: https://www.snapeda.com/parts/HTSW10207TMS/Samtec/view-part/?ref=eda; Package: None; Price: None
LED20-LED39 = LED 2x3x4: as LED00 on sheet spectrum_8kHz_64Hz; SnapEDA_Link: https://www.snapeda.com/parts/TLLG4400/Vishay/view-part/?ref=snap; Availability: In Stock; Package: None; Check_prices: https://www.snapeda.com/parts/TLLG4400/Vishay/view-part/?ref=eda; Value: *; Purchase-URL: https://pricing.snapeda.com/search/part/TLLG4400/?ref=eda; Price: None
R20 = RESISTOR 0805: 43Ohm Resistor 0805; Part Number: TNPW080510K0BETA; Manufacturer: Vishay Dale
R21 = RESISTOR 0805: 16,2k Resistor 0805; Part Number: TNPW080510K0BETA; Manufacturer: Vishay Dale
R22 R23 R26 R27 R33 = RESISTOR 0805: as R1 on sheet AudioIN
R24 = RESISTOR 0805: as R12 on sheet spectrum_8kHz_64Hz
R25 = RESISTOR 0805: 301 Resistor 0805; Part Number: TNPW080510K0BETA; Manufacturer: Vishay Dale
R28 = RESISTOR 0805: 120k Resistor 0805; Part Number: TNPW080510K0BETA; Manufacturer: Vishay Dale
R29 = RESISTOR 0805: 8,2k Resistor 0805; Part Number: TNPW080510K0BETA; Manufacturer: Vishay Dale
R30 = RESISTOR 0805: as R6 on sheet spectrum_8kHz_64Hz
R31 R35 = RESISTOR 0805: as R7 on sheet spectrum_8kHz_64Hz
R32 R34 = RESISTOR 0805: as R8 on sheet spectrum_8kHz_64Hz
U3 U4 = LM3915: MP: LM3914N-1; Package: None; Availability: Unavailable; Price: None; Value: *

## Sheet spectrum_2kHz_250Hz.SchDoc
size A4; SheetNumber: 4; SheetTotal: 6
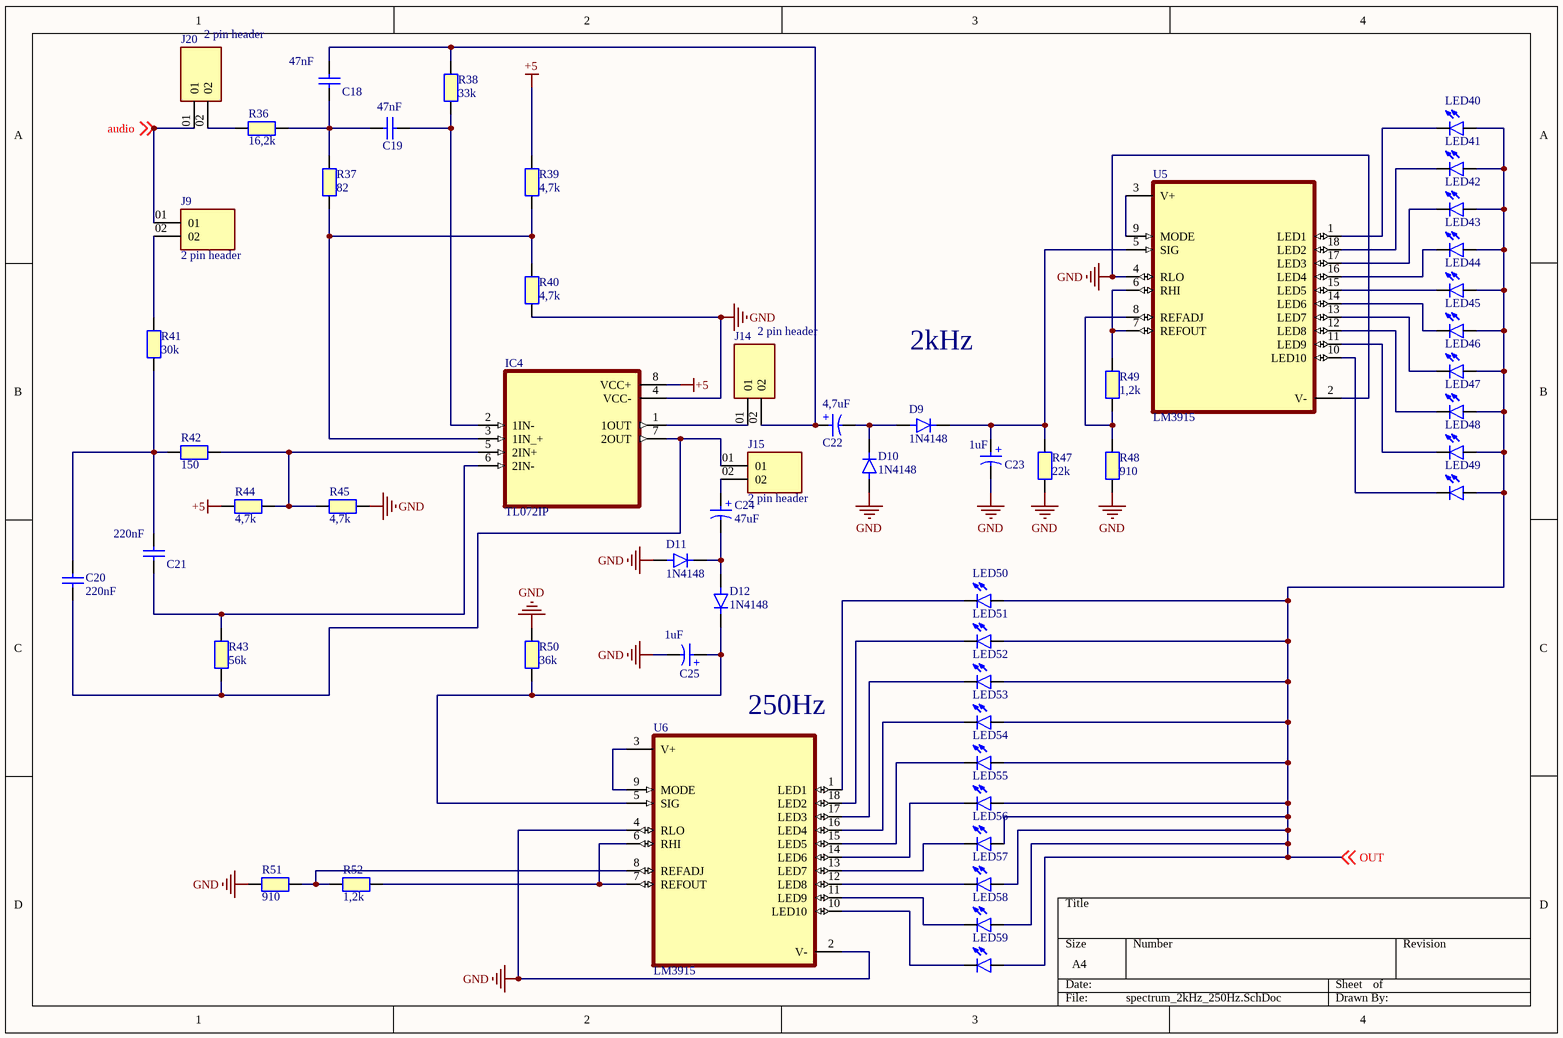
[diagram p3: spectrum_2kHz_250Hz.SchDoc]

### Parts
C18  47nF  [CAPC2012X65N]
C19  47nF  [CAPC2012X65N]
C20  220nF  [CAPC2012X65N]
C21  220nF  [CAPC2012X65N]
C22  4,7uF  [WCAP-ATG8_D5H11]
C23  1uF  [WCAP-ATG8_D5H11]
C24  47uF  [WCAP-ATG8_D5H11]
C25  1uF  [WCAP-ATG8_D5H11]
D9  1N4148  [DIOAD829W49L456D191]
D10  1N4148  [DIOAD829W49L456D191]
D11  1N4148  [DIOAD829W49L456D191]
D12  1N4148  [DIOAD829W49L456D191]
IC4  TL072IP  [DIP794W45P254L959H508Q8]
J9  2 pin header  [SAMTEC_HTSW-102-07-TM-S]
J14  2 pin header  [SAMTEC_HTSW-102-07-TM-S]
J15  2 pin header  [SAMTEC_HTSW-102-07-TM-S]
J20  2 pin header  [SAMTEC_HTSW-102-07-TM-S]
LED40  LED 2x3x4  [LED 2x3x4mm]  (value not drawn)
LED41  LED 2x3x4  [LED 2x3x4mm]  (value not drawn)
LED42  LED 2x3x4  [LED 2x3x4mm]  (value not drawn)
LED43  LED 2x3x4  [LED 2x3x4mm]  (value not drawn)
LED44  LED 2x3x4  [LED 2x3x4mm]  (value not drawn)
LED45  LED 2x3x4  [LED 2x3x4mm]  (value not drawn)
LED46  LED 2x3x4  [LED 2x3x4mm]  (value not drawn)
LED47  LED 2x3x4  [LED 2x3x4mm]  (value not drawn)
LED48  LED 2x3x4  [LED 2x3x4mm]  (value not drawn)
LED49  LED 2x3x4  [LED 2x3x4mm]  (value not drawn)
LED50  LED 2x3x4  [LED 2x3x4mm]  (value not drawn)
LED51  LED 2x3x4  [LED 2x3x4mm]  (value not drawn)
LED52  LED 2x3x4  [LED 2x3x4mm]  (value not drawn)
LED53  LED 2x3x4  [LED 2x3x4mm]  (value not drawn)
LED54  LED 2x3x4  [LED 2x3x4mm]  (value not drawn)
LED55  LED 2x3x4  [LED 2x3x4mm]  (value not drawn)
LED56  LED 2x3x4  [LED 2x3x4mm]  (value not drawn)
LED57  LED 2x3x4  [LED 2x3x4mm]  (value not drawn)
LED58  LED 2x3x4  [LED 2x3x4mm]  (value not drawn)
LED59  LED 2x3x4  [LED 2x3x4mm]  (value not drawn)
R36  16,2k  [RESC2012X50N]
R37  82  [RESC2012X50N]
R38  33k  [RESC2012X50N]
R39  4,7k  [RESC2012X50N]
R40  4,7k  [RESC2012X50N]
R41  30k  [RESC2012X50N]
R42  150  [RESC2012X50N]
R43  56k  [RESC2012X50N]
R44  4,7k  [RESC2012X50N]
R45  4,7k  [RESC2012X50N]
R47  22k  [RESC2012X50N]
R48  910  [RESC2012X50N]
R49  1,2k  [RESC2012X50N]
R50  36k  [RESC2012X50N]
R51  910  [RESC2012X50N]
R52  1,2k  [RESC2012X50N]
U5  LM3915  [DIP952W45P254L2336H533Q18]
U6  LM3915  [DIP952W45P254L2336H533Q18]

### Nets
+5: IC4.8(VCC+) R39.2 R44.2
GND: C23.2(N) C25.2(N) D10.A D11.A IC4.4(VCC-) R40.1 R45.2 R47.1 R48.2 R50.1 R51.2 U5.2(V-) U5.4(RLO) U6.2(V-) U6.4(RLO)
audio: J9.01 J20.01 ; off-sheet audio
OUT: LED40.A LED41.A LED42.A LED43.A LED44.A LED45.A LED46.A LED47.A LED48.A LED49.A LED50.A LED51.A LED52.A LED53.A LED54.A LED55.A LED56.A LED57.A LED58.A LED59.A ; off-sheet OUT
NetC18_1: C18.1 C19.1 R36.2 R37.2
NetC18_2: C18.2 C22.1(P) J14.02 R38.2
NetC19_2: C19.2 IC4.2(1IN-) R38.1
NetC20_1: C20.1 IC4.7(2OUT) J15.01 R43.1
NetC20_2: C20.2 C21.2 R41.1 R42.2
NetC21_1: C21.1 IC4.6(2IN-) R43.2
NetC22_2: C22.2(N) D9.A D10.C
NetC23_1: C23.1(P) D9.C R47.2 U5.5(SIG)
NetC24_1: C24.1(P) J15.02
NetC24_2: C24.2(N) D11.C D12.A
NetC25_1: C25.1(P) D12.C R50.2 U6.5(SIG)
NetIC4_1: IC4.1(1OUT) J14.01
NetIC4_3: IC4.3(1IN_+) R37.1 R39.1 R40.2
NetIC4_5: IC4.5(2IN+) R42.1 R44.1 R45.1
NetJ9_02: J9.02 R41.2
NetJ20_02: J20.02 R36.1
NetLED40_K: LED40.K(C) U5.1(LED1)
NetLED41_K: LED41.K(C) U5.18(LED2)
NetLED42_K: LED42.K(C) U5.17(LED3)
NetLED43_K: LED43.K(C) U5.16(LED4)
NetLED44_K: LED44.K(C) U5.15(LED5)
NetLED45_K: LED45.K(C) U5.14(LED6)
NetLED46_K: LED46.K(C) U5.13(LED7)
NetLED47_K: LED47.K(C) U5.12(LED8)
NetLED48_K: LED48.K(C) U5.11(LED9)
NetLED49_K: LED49.K(C) U5.10(LED10)
NetLED50_K: LED50.K(C) U6.1(LED1)
NetLED51_K: LED51.K(C) U6.18(LED2)
NetLED52_K: LED52.K(C) U6.17(LED3)
NetLED53_K: LED53.K(C) U6.16(LED4)
NetLED54_K: LED54.K(C) U6.15(LED5)
NetLED55_K: LED55.K(C) U6.14(LED6)
NetLED56_K: LED56.K(C) U6.13(LED7)
NetLED57_K: LED57.K(C) U6.12(LED8)
NetLED58_K: LED58.K(C) U6.11(LED9)
NetLED59_K: LED59.K(C) U6.10(LED10)
NetR48_1: R48.1 R49.2 U5.8(REFADJ)
NetR49_1: R49.1 U5.6(RHI) U5.7(REFOUT)
NetR51_1: R51.1 R52.2 U6.8(REFADJ)
NetR52_1: R52.1 U6.6(RHI) U6.7(REFOUT)
NetU5_3: U5.3(V+) U5.9(MODE)
NetU6_3: U6.3(V+) U6.9(MODE)

### Notes on the sheet
- 2kHz
- (near U6) 250Hz
- (in symbol 860010272005) +

### Library data of the parts
C18 C19 = 885012004008: as C10 on sheet spectrum_4kHz_125Hz; Manufacturer Part Number: 885012004008; Category: Multilayer Ceramic Chip Capacitors; ComponentLink1Description: Website Link; ComponentLink1URL: https://www.we-online.com/redexpert/article/885012004008?ad; ComponentLink2Description: Datasheet Link; ComponentLink2URL: https://www.we-online.com/redexpert/spec/885012004008?ad; Mount: Surface Mount; Operating Temperature Max: 125°C; Operating Temperature Min: -55°C; Packaging: Tape and Reel; Length: 0.6mm; Width: 0.3mm; Height: 0.3mm
C20 C21 = 885012004008: as C12 on sheet spectrum_4kHz_125Hz; Manufacturer Part Number: 885012004008; Category: Multilayer Ceramic Chip Capacitors; ComponentLink1Description: Website Link; ComponentLink1URL: https://www.we-online.com/redexpert/article/885012004008?ad; ComponentLink2Description: Datasheet Link; ComponentLink2URL: https://www.we-online.com/redexpert/spec/885012004008?ad; Mount: Surface Mount; Operating Temperature Max: 125°C; Operating Temperature Min: -55°C; Packaging: Tape and Reel; Length: 0.6mm; Width: 0.3mm; Height: 0.3mm
C22 = 860010272005: Elco 4,7uF; Manufacturer: Wurth Elektronik; Match Code: WCAP-ATG8; Capacitance: 100µF; Capacitance Tolerance: +/-20%; Dissipation Factor: 19%; Endurance: 2000h; Leakage Current: 10µA; Rated Voltage (DC): 10V; Ripple Current: 198mA; Technical Reference: ATBC110101M010DSPA3B000; Manufacturer Part Number: 860010272005; Category: Aluminum Electrolytic Capacitors; ComponentLink1Description: Website Link; ComponentLink1URL: https://www.we-online.com/redexpert/article/860010272005?ad; ComponentLink2Description: Datasheet Link; ComponentLink2URL: https://www.we-online.com/redexpert/spec/860010272005?ad; Mount: Through Hole; Operating Temperature Max: 85°C; Operating Temperature Min: -40°C; Packaging: Ammo Pack; Height: 11mm; Diameter: 5mm
C23 = 860010272005: as C5 on sheet spectrum_8kHz_64Hz; Manufacturer Part Number: 860010272005; Category: Aluminum Electrolytic Capacitors; Match Code: WCAP-ATG8; ComponentLink1Description: Website Link; ComponentLink1URL: https://www.we-online.com/redexpert/article/860010272005?ad; ComponentLink2Description: Datasheet Link; ComponentLink2URL: https://www.we-online.com/redexpert/spec/860010272005?ad; Mount: Through Hole; Operating Temperature Max: 85°C; Operating Temperature Min: -40°C; Packaging: Ammo Pack; Height: 11mm; Diameter: 5mm; Rated Voltage (DC): 10V
C24 = 860010272005: as C16 on sheet spectrum_4kHz_125Hz; Manufacturer Part Number: 860010272005; Category: Aluminum Electrolytic Capacitors; ComponentLink1Description: Website Link; ComponentLink1URL: https://www.we-online.com/redexpert/article/860010272005?ad; ComponentLink2Description: Datasheet Link; ComponentLink2URL: https://www.we-online.com/redexpert/spec/860010272005?ad; Mount: Through Hole; Operating Temperature Max: 85°C; Operating Temperature Min: -40°C; Packaging: Ammo Pack; Height: 11mm; Diameter: 5mm
C25 = 860010272005: WCAP-ATG8 Aluminum Electrolytic Capacitor, Radial, THT, D5 x H11mm, 1µF, 10V; Manufacturer: Wurth Elektronik; Capacitance: 100µF; Capacitance Tolerance: +/-20%; Dissipation Factor: 19%; Endurance: 2000h; Leakage Current: 10µA; Ripple Current: 198mA; Technical Reference: ATBC110101M010DSPA3B000; Manufacturer Part Number: 860010272005; Category: Aluminum Electrolytic Capacitors; Match Code: WCAP-ATG8; ComponentLink1Description: Website Link; ComponentLink1URL: https://www.we-online.com/redexpert/article/860010272005?ad; ComponentLink2Description: Datasheet Link; ComponentLink2URL: https://www.we-online.com/redexpert/spec/860010272005?ad; Mount: Through Hole; Operating Temperature Max: 85°C; Operating Temperature Min: -40°C; Packaging: Ammo Pack; Height: 11mm; Diameter: 5mm; Rated Voltage (DC): 10V
D9-D12 = 1N4148: as D1 on sheet spectrum_8kHz_64Hz; Price: None; Availability: In Stock; Package: AXIAL LEAD-2 ON Semiconductor; MP: 1N4148; Value: *; SnapEDA_Link: https://www.snapeda.com/parts/1N4148/Onsemi/view-part/?ref=snap; Purchase-URL: https://pricing.snapeda.com/search/part/1N4148/?ref=eda; Check_prices: https://www.snapeda.com/parts/1N4148/Onsemi/view-part/?ref=eda
IC4 = TL072IP: as IC2 on sheet spectrum_8kHz_64Hz; Price: None; Package: PDIP-8 Texas; Purchase-URL: https://pricing.snapeda.com/search/part/TL072IP/?ref=eda; Availability: In Stock; SnapEDA_Link: https://www.snapeda.com/parts/TL072IP/Texas+Instruments/view-part/?ref=snap; Value: *; MP: TL072IP; Check_prices: https://www.snapeda.com/parts/TL072IP/Texas+Instruments/view-part/?ref=eda
J9 J14 J15 J20 = 2 pin header: as J4 on sheet AudioIN; SnapEDA_Link: https://www.snapeda.com/parts/HTSW10207TMS/Samtec/view-part/?ref=snap; Value: *; Purchase-URL: https://pricing.snapeda.com/search/part/HTSW10207TMS/?ref=eda; Availability: In Stock; Check_prices: https://www.snapeda.com/parts/HTSW10207TMS/Samtec/view-part/?ref=eda; Package: None; Price: None
LED40-LED59 = LED 2x3x4: as LED00 on sheet spectrum_8kHz_64Hz; SnapEDA_Link: https://www.snapeda.com/parts/TLLG4400/Vishay/view-part/?ref=snap; Availability: In Stock; Package: None; Check_prices: https://www.snapeda.com/parts/TLLG4400/Vishay/view-part/?ref=eda; Value: *; Purchase-URL: https://pricing.snapeda.com/search/part/TLLG4400/?ref=eda; Price: None
R36 = RESISTOR 0805: 16.2k Resistor 0805; Part Number: TNPW080510K0BETA; Manufacturer: Vishay Dale
R37 = RESISTOR 0805: 82Ohm Resistor 0805; Part Number: TNPW080510K0BETA; Manufacturer: Vishay Dale
R38 = RESISTOR 0805: 33k Resistor 0805; Part Number: TNPW080510K0BETA; Manufacturer: Vishay Dale
R39 R40 R44 R45 R50 = RESISTOR 0805: as R1 on sheet AudioIN
R41 = RESISTOR 0805: 30k Resistor 0805; Part Number: TNPW080510K0BETA; Manufacturer: Vishay Dale
R42 = RESISTOR 0805: 150 Resistor 0805; Part Number: TNPW080510K0BETA; Manufacturer: Vishay Dale
R43 = RESISTOR 0805: 56k Resistor 0805; Part Number: TNPW080510K0BETA; Manufacturer: Vishay Dale
R47 = RESISTOR 0805: as R6 on sheet spectrum_8kHz_64Hz
R48 R51 = RESISTOR 0805: as R8 on sheet spectrum_8kHz_64Hz
R49 R52 = RESISTOR 0805: as R7 on sheet spectrum_8kHz_64Hz
U5 U6 = LM3915: MP: LM3914N-1; Package: None; Availability: Unavailable; Price: None; Value: *

## Sheet spectrum_1kHz_500Hz.SchDoc
size A4; SheetNumber: 5; SheetTotal: 6
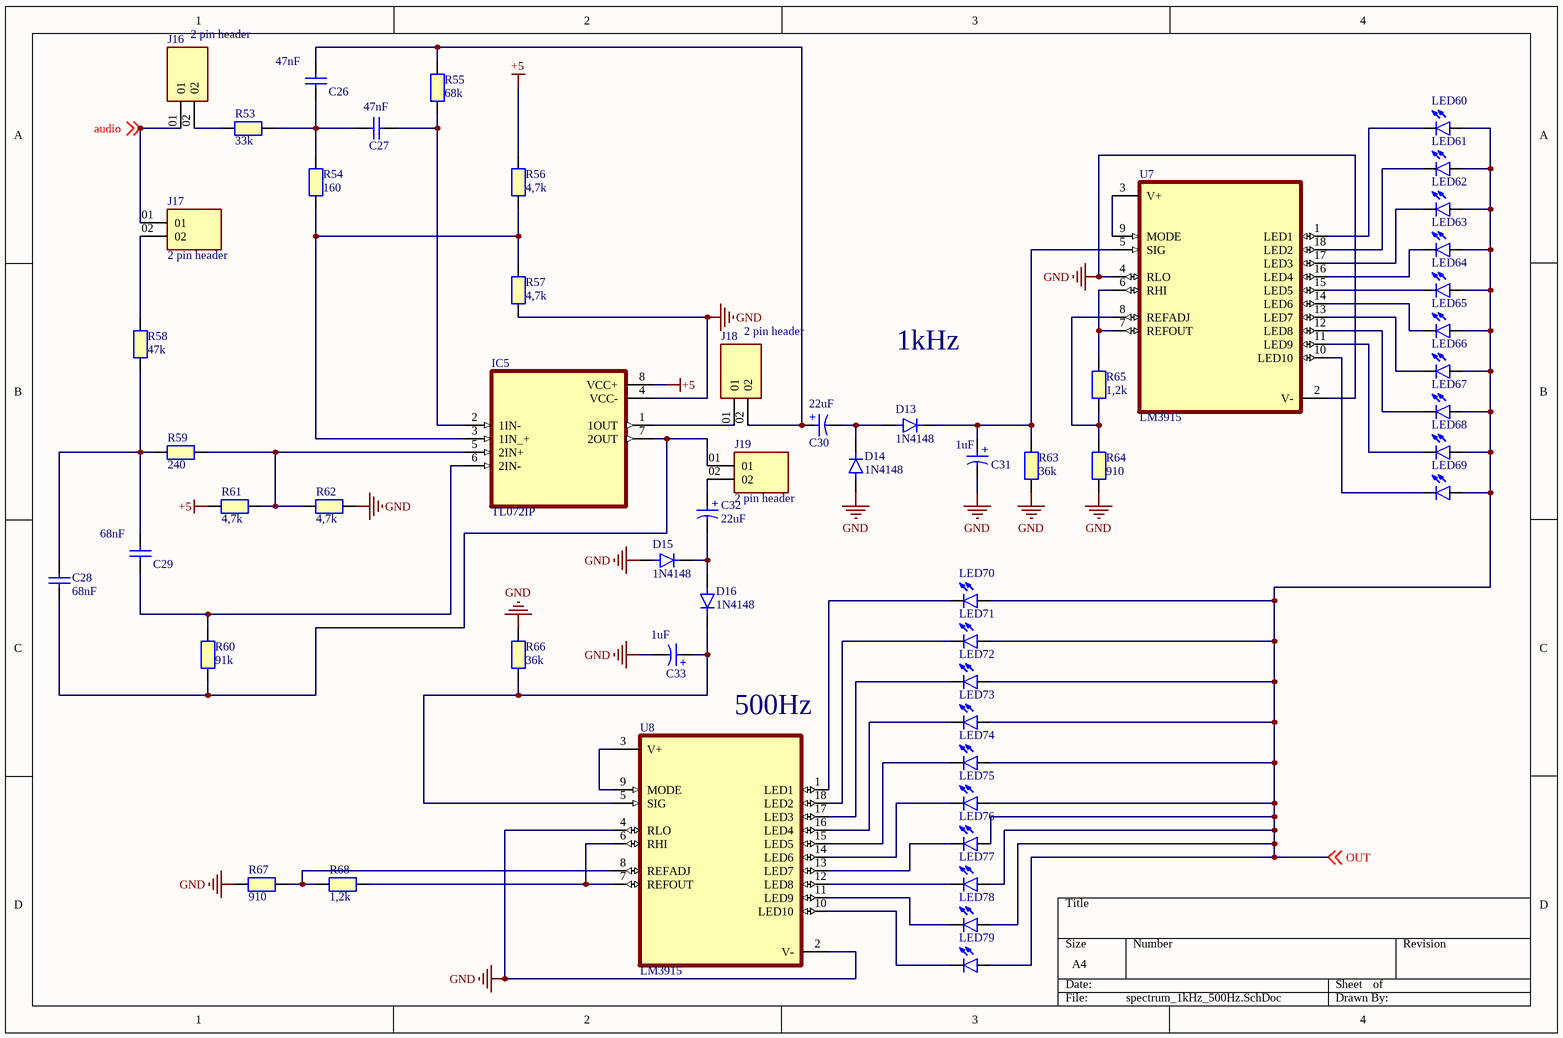
[diagram p4: spectrum_1kHz_500Hz.SchDoc]

### Parts
C26  47nF  [CAPC2012X65N]
C27  47nF  [CAPC2012X65N]
C28  68nF  [CAPC2012X65N]
C29  68nF  [CAPC2012X65N]
C30  22uF  [WCAP-ATG8_D5H11]
C31  1uF  [WCAP-ATG8_D5H11]
C32  22uF  [WCAP-ATG8_D5H11]
C33  1uF  [WCAP-ATG8_D5H11]
D13  1N4148  [DIOAD829W49L456D191]
D14  1N4148  [DIOAD829W49L456D191]
D15  1N4148  [DIOAD829W49L456D191]
D16  1N4148  [DIOAD829W49L456D191]
IC5  TL072IP  [DIP794W45P254L959H508Q8]
J16  2 pin header  [SAMTEC_HTSW-102-07-TM-S]
J17  2 pin header  [SAMTEC_HTSW-102-07-TM-S]
J18  2 pin header  [SAMTEC_HTSW-102-07-TM-S]
J19  2 pin header  [SAMTEC_HTSW-102-07-TM-S]
LED60  LED 2x3x4  [LED 2x3x4mm]  (value not drawn)
LED61  LED 2x3x4  [LED 2x3x4mm]  (value not drawn)
LED62  LED 2x3x4  [LED 2x3x4mm]  (value not drawn)
LED63  LED 2x3x4  [LED 2x3x4mm]  (value not drawn)
LED64  LED 2x3x4  [LED 2x3x4mm]  (value not drawn)
LED65  LED 2x3x4  [LED 2x3x4mm]  (value not drawn)
LED66  LED 2x3x4  [LED 2x3x4mm]  (value not drawn)
LED67  LED 2x3x4  [LED 2x3x4mm]  (value not drawn)
LED68  LED 2x3x4  [LED 2x3x4mm]  (value not drawn)
LED69  LED 2x3x4  [LED 2x3x4mm]  (value not drawn)
LED70  LED 2x3x4  [LED 2x3x4mm]  (value not drawn)
LED71  LED 2x3x4  [LED 2x3x4mm]  (value not drawn)
LED72  LED 2x3x4  [LED 2x3x4mm]  (value not drawn)
LED73  LED 2x3x4  [LED 2x3x4mm]  (value not drawn)
LED74  LED 2x3x4  [LED 2x3x4mm]  (value not drawn)
LED75  LED 2x3x4  [LED 2x3x4mm]  (value not drawn)
LED76  LED 2x3x4  [LED 2x3x4mm]  (value not drawn)
LED77  LED 2x3x4  [LED 2x3x4mm]  (value not drawn)
LED78  LED 2x3x4  [LED 2x3x4mm]  (value not drawn)
LED79  LED 2x3x4  [LED 2x3x4mm]  (value not drawn)
R53  33k  [RESC2012X50N]
R54  160  [RESC2012X50N]
R55  68k  [RESC2012X50N]
R56  4,7k  [RESC2012X50N]
R57  4,7k  [RESC2012X50N]
R58  47k  [RESC2012X50N]
R59  240  [RESC2012X50N]
R60  91k  [RESC2012X50N]
R61  4,7k  [RESC2012X50N]
R62  4,7k  [RESC2012X50N]
R63  36k  [RESC2012X50N]
R64  910  [RESC2012X50N]
R65  1,2k  [RESC2012X50N]
R66  36k  [RESC2012X50N]
R67  910  [RESC2012X50N]
R68  1,2k  [RESC2012X50N]
U7  LM3915  [DIP952W45P254L2336H533Q18]
U8  LM3915  [DIP952W45P254L2336H533Q18]

### Nets
+5: IC5.8(VCC+) R56.2 R61.2
GND: C31.2(N) C33.2(N) D14.A D15.A IC5.4(VCC-) R57.1 R62.2 R63.1 R64.2 R66.1 R67.2 U7.2(V-) U7.4(RLO) U8.2(V-) U8.4(RLO)
audio: J16.01 J17.01 ; off-sheet audio
OUT: LED60.A LED61.A LED62.A LED63.A LED64.A LED65.A LED66.A LED67.A LED68.A LED69.A LED70.A LED71.A LED72.A LED73.A LED74.A LED75.A LED76.A LED77.A LED78.A LED79.A ; off-sheet OUT
NetC26_1: C26.1 C27.1 R53.2 R54.2
NetC26_2: C26.2 C30.1(P) J18.02 R55.2
NetC27_2: C27.2 IC5.2(1IN-) R55.1
NetC28_1: C28.1 IC5.7(2OUT) J19.01 R60.1
NetC28_2: C28.2 C29.2 R58.1 R59.2
NetC29_1: C29.1 IC5.6(2IN-) R60.2
NetC30_2: C30.2(N) D13.A D14.C
NetC31_1: C31.1(P) D13.C R63.2 U7.5(SIG)
NetC32_1: C32.1(P) J19.02
NetC32_2: C32.2(N) D15.C D16.A
NetC33_1: C33.1(P) D16.C R66.2 U8.5(SIG)
NetIC5_1: IC5.1(1OUT) J18.01
NetIC5_3: IC5.3(1IN_+) R54.1 R56.1 R57.2
NetIC5_5: IC5.5(2IN+) R59.1 R61.1 R62.1
NetJ16_02: J16.02 R53.1
NetJ17_02: J17.02 R58.2
NetLED60_K: LED60.K(C) U7.1(LED1)
NetLED61_K: LED61.K(C) U7.18(LED2)
NetLED62_K: LED62.K(C) U7.17(LED3)
NetLED63_K: LED63.K(C) U7.16(LED4)
NetLED64_K: LED64.K(C) U7.15(LED5)
NetLED65_K: LED65.K(C) U7.14(LED6)
NetLED66_K: LED66.K(C) U7.13(LED7)
NetLED67_K: LED67.K(C) U7.12(LED8)
NetLED68_K: LED68.K(C) U7.11(LED9)
NetLED69_K: LED69.K(C) U7.10(LED10)
NetLED70_K: LED70.K(C) U8.1(LED1)
NetLED71_K: LED71.K(C) U8.18(LED2)
NetLED72_K: LED72.K(C) U8.17(LED3)
NetLED73_K: LED73.K(C) U8.16(LED4)
NetLED74_K: LED74.K(C) U8.15(LED5)
NetLED75_K: LED75.K(C) U8.14(LED6)
NetLED76_K: LED76.K(C) U8.13(LED7)
NetLED77_K: LED77.K(C) U8.12(LED8)
NetLED78_K: LED78.K(C) U8.11(LED9)
NetLED79_K: LED79.K(C) U8.10(LED10)
NetR64_1: R64.1 R65.2 U7.8(REFADJ)
NetR65_1: R65.1 U7.6(RHI) U7.7(REFOUT)
NetR67_1: R67.1 R68.2 U8.8(REFADJ)
NetR68_1: R68.1 U8.6(RHI) U8.7(REFOUT)
NetU7_3: U7.3(V+) U7.9(MODE)
NetU8_3: U8.3(V+) U8.9(MODE)

### Notes on the sheet
- 1kHz
- (near U8) 500Hz
- (in symbol 860010272005) +

### Library data of the parts
C26 C27 = 885012004008: as C10 on sheet spectrum_4kHz_125Hz; Manufacturer Part Number: 885012004008; Category: Multilayer Ceramic Chip Capacitors; ComponentLink1Description: Website Link; ComponentLink1URL: https://www.we-online.com/redexpert/article/885012004008?ad; ComponentLink2Description: Datasheet Link; ComponentLink2URL: https://www.we-online.com/redexpert/spec/885012004008?ad; Mount: Surface Mount; Operating Temperature Max: 125°C; Operating Temperature Min: -55°C; Packaging: Tape and Reel; Length: 0.6mm; Width: 0.3mm; Height: 0.3mm
C28 C29 = 885012004008: 68nF ceramic; Manufacturer: Wurth Elektronik; Match Code: WCAP-CSGP; Case/Size Code: 0201; Capacitance: 22pF; Capacitance Tolerance: +/-5%; Ceramic Type: NP0 Class I; Insulation Resistance: 10GΩ; Q Factor: 840; Rated Voltage (DC): 25V; Technical Reference: NP00201220J025DFCT10000; Manufacturer Part Number: 885012004008; Category: Multilayer Ceramic Chip Capacitors; ComponentLink1Description: Website Link; ComponentLink1URL: https://www.we-online.com/redexpert/article/885012004008?ad; ComponentLink2Description: Datasheet Link; ComponentLink2URL: https://www.we-online.com/redexpert/spec/885012004008?ad; Mount: Surface Mount; Operating Temperature Max: 125°C; Operating Temperature Min: -55°C; Packaging: Tape and Reel; Length: 0.6mm; Width: 0.3mm; Height: 0.3mm
C30 C32 = 860010272005: Elco 22uF; Manufacturer: Wurth Elektronik; Match Code: WCAP-ATG8; Capacitance: 100µF; Capacitance Tolerance: +/-20%; Dissipation Factor: 19%; Endurance: 2000h; Leakage Current: 10µA; Rated Voltage (DC): 10V; Ripple Current: 198mA; Technical Reference: ATBC110101M010DSPA3B000; Manufacturer Part Number: 860010272005; Category: Aluminum Electrolytic Capacitors; ComponentLink1Description: Website Link; ComponentLink1URL: https://www.we-online.com/redexpert/article/860010272005?ad; ComponentLink2Description: Datasheet Link; ComponentLink2URL: https://www.we-online.com/redexpert/spec/860010272005?ad; Mount: Through Hole; Operating Temperature Max: 85°C; Operating Temperature Min: -40°C; Packaging: Ammo Pack; Height: 11mm; Diameter: 5mm
C31 = 860010272005: as C5 on sheet spectrum_8kHz_64Hz; Manufacturer Part Number: 860010272005; Category: Aluminum Electrolytic Capacitors; Match Code: WCAP-ATG8; ComponentLink1Description: Website Link; ComponentLink1URL: https://www.we-online.com/redexpert/article/860010272005?ad; ComponentLink2Description: Datasheet Link; ComponentLink2URL: https://www.we-online.com/redexpert/spec/860010272005?ad; Mount: Through Hole; Operating Temperature Max: 85°C; Operating Temperature Min: -40°C; Packaging: Ammo Pack; Height: 11mm; Diameter: 5mm; Rated Voltage (DC): 10V
C33 = 860010272005: as C25 on sheet spectrum_2kHz_250Hz; Manufacturer Part Number: 860010272005; Category: Aluminum Electrolytic Capacitors; Match Code: WCAP-ATG8; ComponentLink1Description: Website Link; ComponentLink1URL: https://www.we-online.com/redexpert/article/860010272005?ad; ComponentLink2Description: Datasheet Link; ComponentLink2URL: https://www.we-online.com/redexpert/spec/860010272005?ad; Mount: Through Hole; Operating Temperature Max: 85°C; Operating Temperature Min: -40°C; Packaging: Ammo Pack; Height: 11mm; Diameter: 5mm; Rated Voltage (DC): 10V
D13-D16 = 1N4148: as D1 on sheet spectrum_8kHz_64Hz; Price: None; Availability: In Stock; Package: AXIAL LEAD-2 ON Semiconductor; MP: 1N4148; Value: *; SnapEDA_Link: https://www.snapeda.com/parts/1N4148/Onsemi/view-part/?ref=snap; Purchase-URL: https://pricing.snapeda.com/search/part/1N4148/?ref=eda; Check_prices: https://www.snapeda.com/parts/1N4148/Onsemi/view-part/?ref=eda
IC5 = TL072IP: as IC2 on sheet spectrum_8kHz_64Hz; Price: None; Package: PDIP-8 Texas; Purchase-URL: https://pricing.snapeda.com/search/part/TL072IP/?ref=eda; Availability: In Stock; SnapEDA_Link: https://www.snapeda.com/parts/TL072IP/Texas+Instruments/view-part/?ref=snap; Value: *; MP: TL072IP; Check_prices: https://www.snapeda.com/parts/TL072IP/Texas+Instruments/view-part/?ref=eda
J16-J19 = 2 pin header: as J4 on sheet AudioIN; SnapEDA_Link: https://www.snapeda.com/parts/HTSW10207TMS/Samtec/view-part/?ref=snap; Value: *; Purchase-URL: https://pricing.snapeda.com/search/part/HTSW10207TMS/?ref=eda; Availability: In Stock; Check_prices: https://www.snapeda.com/parts/HTSW10207TMS/Samtec/view-part/?ref=eda; Package: None; Price: None
LED60-LED79 = LED 2x3x4: as LED00 on sheet spectrum_8kHz_64Hz; SnapEDA_Link: https://www.snapeda.com/parts/TLLG4400/Vishay/view-part/?ref=snap; Availability: In Stock; Package: None; Check_prices: https://www.snapeda.com/parts/TLLG4400/Vishay/view-part/?ref=eda; Value: *; Purchase-URL: https://pricing.snapeda.com/search/part/TLLG4400/?ref=eda; Price: None
R53 = RESISTOR 0805: as R38 on sheet spectrum_2kHz_250Hz
R54 = RESISTOR 0805: 160Ohm Resistor 0805; Part Number: TNPW080510K0BETA; Manufacturer: Vishay Dale
R55 = RESISTOR 0805: 68k Resistor 0805; Part Number: TNPW080510K0BETA; Manufacturer: Vishay Dale
R56 R57 R61 R62 R66 = RESISTOR 0805: as R1 on sheet AudioIN
R58 = RESISTOR 0805: 47k Resistor 0805; Part Number: TNPW080510K0BETA; Manufacturer: Vishay Dale
R59 = RESISTOR 0805: 240 resistor 0805; Part Number: TNPW080510K0BETA; Manufacturer: Vishay Dale
R60 = RESISTOR 0805: 91k Resistor 0805; Part Number: TNPW080510K0BETA; Manufacturer: Vishay Dale
R63 = RESISTOR 0805: 36k Resistor 0805; Part Number: TNPW080510K0BETA; Manufacturer: Vishay Dale
R64 R67 = RESISTOR 0805: as R8 on sheet spectrum_8kHz_64Hz
R65 R68 = RESISTOR 0805: as R7 on sheet spectrum_8kHz_64Hz
U7 U8 = LM3915: MP: LM3914N-1; Package: None; Availability: Unavailable; Price: None; Value: *